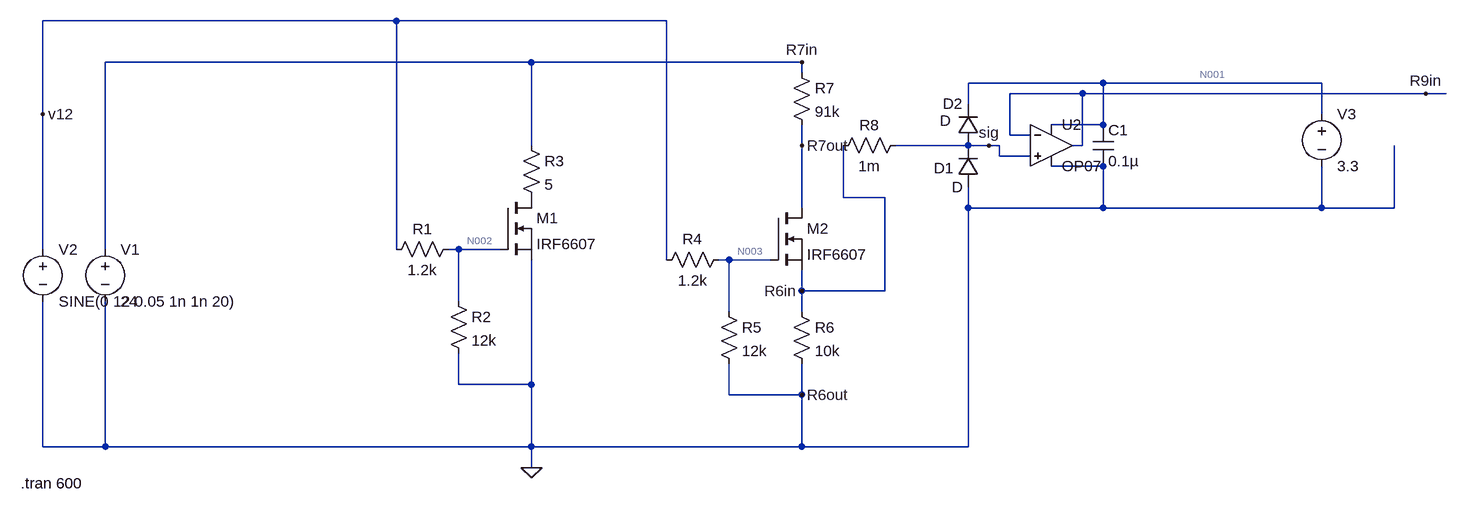
[diagram p0: schematic voltage_output.asc]
voltage_output.asc, the LTspice schematic file:
Version 4
SHEET 1 1864 680
WIRE 144 -464 -400 -464
WIRE 560 -464 144 -464
WIRE 352 -400 -304 -400
WIRE 768 -400 352 -400
WIRE 768 -384 768 -400
WIRE 1232 -368 1024 -368
WIRE 1568 -368 1232 -368
WIRE 1200 -352 1088 -352
WIRE 1728 -352 1200 -352
WIRE 1760 -352 1728 -352
WIRE 1024 -336 1024 -368
WIRE -400 -320 -400 -464
WIRE 1568 -320 1568 -368
WIRE 1232 -304 1232 -368
WIRE 1232 -304 1152 -304
WIRE 1088 -288 1088 -352
WIRE 1120 -288 1088 -288
WIRE 352 -272 352 -400
WIRE 768 -272 768 -304
WIRE 1024 -272 912 -272
WIRE 1056 -272 1024 -272
WIRE 1072 -272 1056 -272
WIRE 1200 -272 1200 -352
WIRE 1200 -272 1184 -272
WIRE 1072 -256 1072 -272
WIRE 1120 -256 1072 -256
WIRE 1232 -240 1152 -240
WIRE 832 -192 832 -272
WIRE 896 -192 832 -192
WIRE 768 -176 768 -272
WIRE 1024 -176 1024 -208
WIRE 1232 -176 1232 -240
WIRE 1232 -176 1024 -176
WIRE 1568 -176 1568 -240
WIRE 1568 -176 1232 -176
WIRE 1680 -176 1680 -272
WIRE 1680 -176 1568 -176
WIRE -400 -112 -400 -320
WIRE -304 -112 -304 -400
WIRE 144 -112 144 -464
WIRE 240 -112 224 -112
WIRE 304 -112 240 -112
WIRE 560 -96 560 -464
WIRE 656 -96 640 -96
WIRE 720 -96 656 -96
WIRE 768 -48 768 -80
WIRE 896 -48 896 -192
WIRE 896 -48 768 -48
WIRE 240 -32 240 -112
WIRE 656 -16 656 -96
WIRE 768 -16 768 -48
WIRE 240 96 240 48
WIRE 352 96 352 -96
WIRE 352 96 240 96
WIRE 656 112 656 64
WIRE 768 112 768 64
WIRE 768 112 656 112
WIRE -400 192 -400 -32
WIRE -304 192 -304 -32
WIRE -304 192 -400 192
WIRE 352 192 352 96
WIRE 352 192 -304 192
WIRE 768 192 768 112
WIRE 768 192 352 192
WIRE 1024 192 1024 -176
WIRE 1024 192 768 192
WIRE 352 224 352 192
FLAG 352 224 0
FLAG 768 -272 R7out
FLAG 768 112 R6out
FLAG 1728 -352 R9in
FLAG 1056 -272 sig
FLAG -400 -320 v12
FLAG 768 -400 R7in
FLAG 768 -48 R6in
SYMBOL nmos 304 -192 R0
SYMATTR InstName M1
SYMATTR Value IRF6607
SYMBOL res 240 -128 R90
WINDOW 0 0 56 VBottom 2
WINDOW 3 32 56 VTop 2
SYMATTR InstName R1
SYMATTR Value 1.2k
SYMBOL res 224 -48 R0
SYMATTR InstName R2
SYMATTR Value 12k
SYMBOL voltage -304 -128 R0
WINDOW 123 0 0 Left 0
WINDOW 39 0 0 Left 0
SYMATTR InstName V1
SYMATTR Value 24
SYMBOL res 336 -288 R0
SYMATTR InstName R3
SYMATTR Value 5
SYMATTR SpiceLine tol=1 pwr=0.1
SYMBOL voltage -400 -128 R0
WINDOW 123 0 0 Left 0
WINDOW 39 0 0 Left 0
SYMATTR InstName V2
SYMATTR Value SINE(0 12 0.05 1n 1n 20)
SYMBOL nmos 720 -176 R0
SYMATTR InstName M2
SYMATTR Value IRF6607
SYMBOL res 656 -112 R90
WINDOW 0 0 56 VBottom 2
WINDOW 3 32 56 VTop 2
SYMATTR InstName R4
SYMATTR Value 1.2k
SYMBOL res 640 -32 R0
SYMATTR InstName R5
SYMATTR Value 12k
SYMBOL res 752 -32 R0
SYMATTR InstName R6
SYMATTR Value 10k
SYMBOL res 752 -400 R0
SYMATTR InstName R7
SYMATTR Value 91k
SYMBOL res 928 -288 R90
WINDOW 0 0 56 VBottom 2
WINDOW 3 32 56 VTop 2
SYMATTR InstName R8
SYMATTR Value 1m
SYMBOL voltage 1568 -336 R0
WINDOW 123 0 0 Left 0
WINDOW 39 0 0 Left 0
SYMATTR InstName V3
SYMATTR Value 3.3
SYMBOL cap 1216 -304 R0
SYMATTR InstName C1
SYMATTR Value 0.1µ
SYMBOL Opamps\\OP07 1152 -336 R0
SYMATTR InstName U2
SYMBOL diode 1040 -208 R180
WINDOW 0 38 29 Left 2
WINDOW 3 24 0 Left 2
SYMATTR InstName D1
SYMBOL diode 1040 -272 R180
WINDOW 0 24 64 Left 2
WINDOW 3 42 38 Left 2
SYMATTR InstName D2
TEXT -434 248 Left 2 !.tran 600

The netlist it stands for:
* voltage_output.asc
M1 P001 N002 0 0 IRF6607
R1 N002 v12 1.2k
R2 N002 0 12k
V1 R7in 0 24
R3 R7in P001 5 tol=1 pwr=0.1
V2 v12 0 SINE(0 12 0.05 1n 1n 20)
M2 R7out N003 R6in R6in IRF6607
R4 N003 v12 1.2k
R5 N003 0 12k
R6 R6in 0 10k
R7 R7in R7out 91k
R8 sig R6in 1m
V3 N001 0 3.3
C1 N001 0 0.1µ
XU2 sig R9in N001 0 R9in LT1001  ; OP07, pins In+ In- V+ V- OUT
D1 0 sig D
D2 sig N001 D
.model D D
.lib standard.dio
.model NMOS NMOS
.model PMOS PMOS
.lib standard.mos
.tran 600
.lib LTC.lib
.backanno
.end

* Results of the author's LTspice run, read from the files saved beside the schematic
* Operating Point, zero values left out:
*   V(p001) = 68.35 mV
*   V(n002) = 3.731 V
*   V(v12) = 4.104 V
*   V(r7in) = 24 V
*   V(r7out) = 4.877 V
*   V(n003) = 3.731 V
*   V(r6in) = 2.101 V
*   V(sig) = 2.101 V
*   V(n001) = 3.3 V
*   V(r9in) = 2.101 V
*   Id(M2) = 210.1 µA
*   Is(M2) = -210.1 µA
*   Id(M1) = 4.786 A
*   Is(M1) = -4.786 A
*   I(D2) = -1.209 pA
*   I(D1) = -2.111 pA
*   I(R8) = -1.776 pA
*   I(R7) = 210.1 µA
*   I(R6) = 210.1 µA
*   I(R5) = 310.9 µA
*   I(R4) = -310.9 µA
*   I(R3) = 4.786 A
*   I(R2) = 310.9 µA
*   I(R1) = -310.9 µA
*   I(V3) = -2.25 mA
*   I(V2) = -621.9 µA
*   I(V1) = -4.787 A
*   Ix(u2:3) = 2.25 mA
*   Ix(u2:4) = -2.25 mA
*   Ix(u2:5) = -1.66 pA
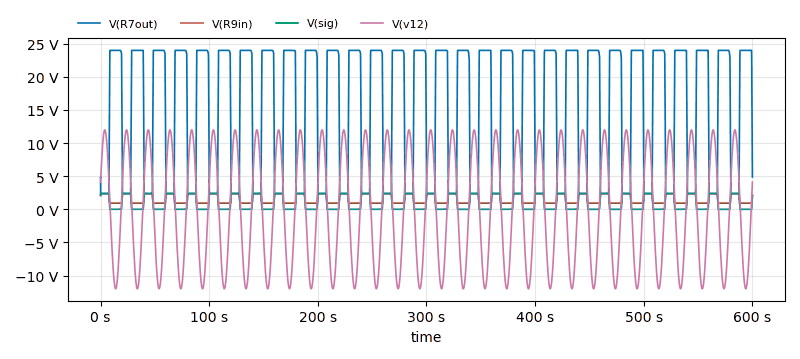
[diagram p1: Transient Analysis of voltage_output.asc, plotted from the saved traces]
* Transient Analysis, 1 run:
*   V(R7out): min 2.375 V, max 24 V, average 14.93 V, rms 18.18 V, last 4.88 V
*   V(R9in): min 929.6 mV, max 2.364 V, average 1.509 V, rms 1.66 V, last 2.101 V
*   V(sig): min -54.6 µV, max 2.377 V, average 996.6 mV, rms 1.514 V, last 2.101 V
*   V(v12): min -12 V, max 12 V, average 1.245 mV, rms 8.483 V, last 4.104 V